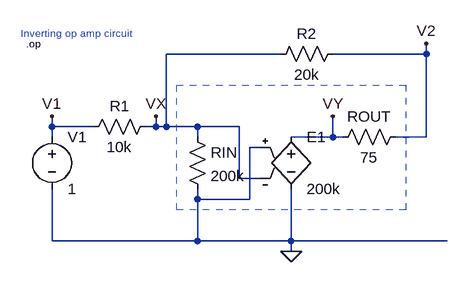
[diagram p0: schematic opamp1.asc]
opamp1.asc, the LTspice schematic file:
Version 4
SHEET 1 880 680
WIRE 272 32 96 32
WIRE 496 32 496 16
WIRE 496 32 352 32
WIRE -80 144 -80 128
WIRE -16 144 -80 144
WIRE 80 144 80 128
WIRE 80 144 64 144
WIRE 96 144 96 32
WIRE 96 144 80 144
WIRE 144 144 96 144
WIRE 208 144 144 144
WIRE -80 160 -80 144
WIRE 144 160 144 144
WIRE 352 160 352 128
WIRE 352 160 288 160
WIRE 368 160 352 160
WIRE 496 160 496 32
WIRE 496 160 448 160
WIRE 240 176 224 176
WIRE 208 224 208 144
WIRE 240 224 208 224
WIRE 144 256 144 240
WIRE 224 256 224 176
WIRE 224 256 144 256
WIRE -80 320 -80 240
WIRE 144 320 144 256
WIRE 144 320 -80 320
WIRE 288 320 288 240
WIRE 288 320 144 320
WIRE 528 320 288 320
WIRE 288 336 288 320
FLAG 288 336 0
FLAG -80 128 V1
FLAG 496 16 V2
FLAG 352 128 VY
FLAG 80 128 VX
DATAFLAG 432 32 ""
DATAFLAG -32 144 ""
DATAFLAG -32 144 ""
DATAFLAG 160 144 ""
DATAFLAG 160 144 ""
DATAFLAG 304 160 ""
DATAFLAG 304 160 ""
SYMBOL res 80 128 R90
WINDOW 0 0 56 VBottom 2
WINDOW 3 32 56 VTop 2
SYMATTR InstName R1
SYMATTR Value 10k
SYMBOL res 368 16 R90
WINDOW 0 0 56 VBottom 2
WINDOW 3 32 56 VTop 2
SYMATTR InstName R2
SYMATTR Value 20k
SYMBOL res 464 144 R90
WINDOW 0 0 56 VBottom 2
WINDOW 3 32 56 VTop 2
SYMATTR InstName ROUT
SYMATTR Value 75
SYMBOL res 128 144 R0
SYMATTR InstName RIN
SYMATTR Value 200k
SYMBOL voltage -80 144 R0
WINDOW 123 0 0 Left 0
WINDOW 39 0 0 Left 0
SYMATTR InstName V1
SYMATTR Value 1
SYMBOL e 288 144 R0
SYMATTR InstName E1
SYMATTR Value 200k
TEXT -120 16 Left 1 !.op
TEXT -128 0 Left 1 ;Inverting op amp circuit
RECTANGLE Normal 464 272 112 80 2

The netlist it stands for:
* opamp1.asc
R1 VX V1 10k
R2 V2 VX 20k
ROUT V2 VY 75
RIN VX 0 200k
V1 V1 0 1
E1 VY 0 0 VX 200k
.op
* Inverting op amp circuit
.backanno
.end